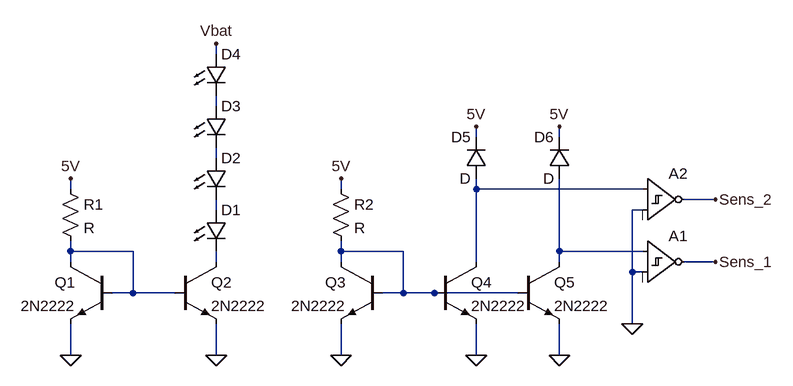
[diagram p0: schematic circuito_sens_linea.asc]
circuito_sens_linea.asc, the LTspice schematic file:
Version 4
SHEET 1 1236 680
WIRE 368 -224 368 -240
WIRE 368 -144 368 -160
WIRE 768 -96 768 -112
WIRE 896 -96 896 -112
WIRE 368 -64 368 -80
WIRE 144 -16 144 -32
WIRE 560 -16 560 -32
WIRE 768 -16 768 -32
WIRE 1024 -16 768 -16
WIRE 1136 0 1088 0
WIRE 368 16 368 0
WIRE 1024 16 1008 16
WIRE 144 80 144 64
WIRE 240 80 144 80
WIRE 560 80 560 64
WIRE 656 80 560 80
WIRE 896 80 896 -32
WIRE 1024 80 896 80
WIRE 144 96 144 80
WIRE 368 96 368 80
WIRE 560 96 560 80
WIRE 768 96 768 -16
WIRE 896 96 896 80
WIRE 1136 96 1088 96
WIRE 1008 112 1008 16
WIRE 1024 112 1008 112
WIRE 240 144 240 80
WIRE 240 144 208 144
WIRE 304 144 240 144
WIRE 656 144 656 80
WIRE 656 144 624 144
WIRE 704 144 656 144
WIRE 832 144 704 144
WIRE 1008 192 1008 112
WIRE 144 240 144 192
WIRE 368 240 368 192
WIRE 560 240 560 192
WIRE 768 240 768 192
WIRE 896 240 896 192
FLAG 144 240 0
FLAG 368 240 0
FLAG 560 240 0
FLAG 768 240 0
FLAG 896 240 0
FLAG 368 -240 Vbat
FLAG 144 -32 5V
FLAG 560 -32 5V
FLAG 768 -112 5V
FLAG 896 -112 5V
FLAG 1008 192 0
FLAG 1136 0 Sens_2
FLAG 1136 96 Sens_1
SYMBOL npn 208 96 M0
SYMATTR InstName Q1
SYMATTR Value 2N2222
SYMBOL res 128 -32 R0
SYMATTR InstName R1
SYMBOL npn 304 96 R0
SYMATTR InstName Q2
SYMATTR Value 2N2222
SYMBOL LED 352 16 R0
SYMATTR InstName D1
SYMATTR Value ""
SYMBOL LED 352 -64 R0
SYMATTR InstName D2
SYMATTR Value ""
SYMBOL LED 352 -144 R0
SYMATTR InstName D3
SYMATTR Value ""
SYMBOL LED 352 -224 R0
SYMATTR InstName D4
SYMATTR Value ""
SYMBOL npn 624 96 M0
SYMATTR InstName Q3
SYMATTR Value 2N2222
SYMBOL res 544 -32 R0
SYMATTR InstName R2
SYMBOL npn 704 96 R0
SYMATTR InstName Q4
SYMATTR Value 2N2222
SYMBOL npn 832 96 R0
SYMATTR InstName Q5
SYMATTR Value 2N2222
SYMBOL diode 784 -32 R180
WINDOW 0 24 64 Left 2
WINDOW 3 24 0 Left 2
SYMATTR InstName D5
SYMBOL diode 912 -32 R180
WINDOW 0 24 64 Left 2
WINDOW 3 24 0 Left 2
SYMATTR InstName D6
SYMBOL Digital\\diffschmtinv 1024 32 R0
SYMATTR InstName A1
SYMBOL Digital\\diffschmtinv 1024 -64 R0
SYMATTR InstName A2

The netlist it stands for:
* circuito_sens_linea.asc
Q1 N005 N005 0 0 2N2222
R1 5V N005 R
Q2 N008 N005 0 0 2N2222
D1 N004 N008
D2 N002 N004
D3 N001 N002
D4 Vbat N001
Q3 N006 N006 0 0 2N2222
R2 5V N006 R
Q4 N003 N006 0 0 2N2222
Q5 N007 N006 0 0 2N2222
D5 N003 5V D
D6 N007 5V D
A1 N007 0 0 0 0 Sens_1 0 0 SCHMITT
A2 N003 0 0 0 0 Sens_2 0 0 SCHMITT
.model D D
.lib standard.dio
.model NPN NPN
.model PNP PNP
.lib standard.bjt
.backanno
.end